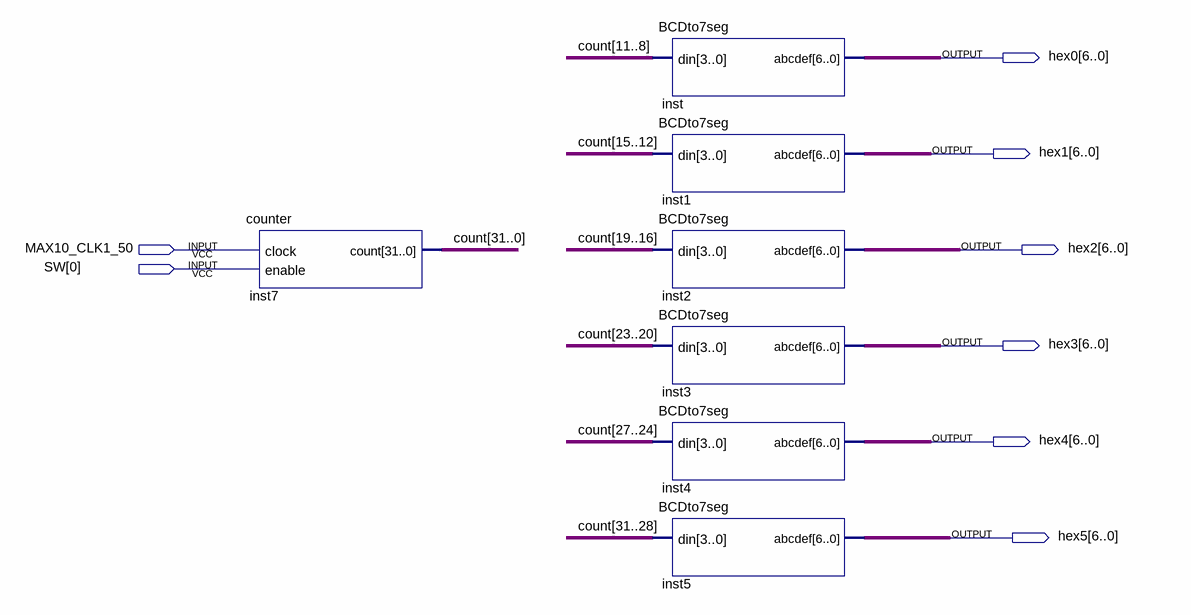
[diagram p0: schematic sheet]
// Quartus schematic de10demo.bdf as structural Verilog: 7 symbols, 8 pins
module de10demo (
  input  MAX10_CLK1_50,
  input  [0:0] SW,
  output [6:0] hex0,
  output [6:0] hex1,
  output [6:0] hex2,
  output [6:0] hex3,
  output [6:0] hex4,
  output [6:0] hex5
);

  wire [31:0] count;

  counter inst7 (.clock(MAX10_CLK1_50), .enable(SW[0]), .count(count));
  BCDto7seg inst (.din(count[11:8]), .abcdef(hex0));
  BCDto7seg inst1 (.din(count[15:12]), .abcdef(hex1));
  BCDto7seg inst2 (.din(count[19:16]), .abcdef(hex2));
  BCDto7seg inst3 (.din(count[23:20]), .abcdef(hex3));
  BCDto7seg inst4 (.din(count[27:24]), .abcdef(hex4));
  BCDto7seg inst5 (.din(count[31:28]), .abcdef(hex5));
endmodule
